# EAGLE design PAM8403 Amplifier Board R2 (EAGLE 9.6.2)
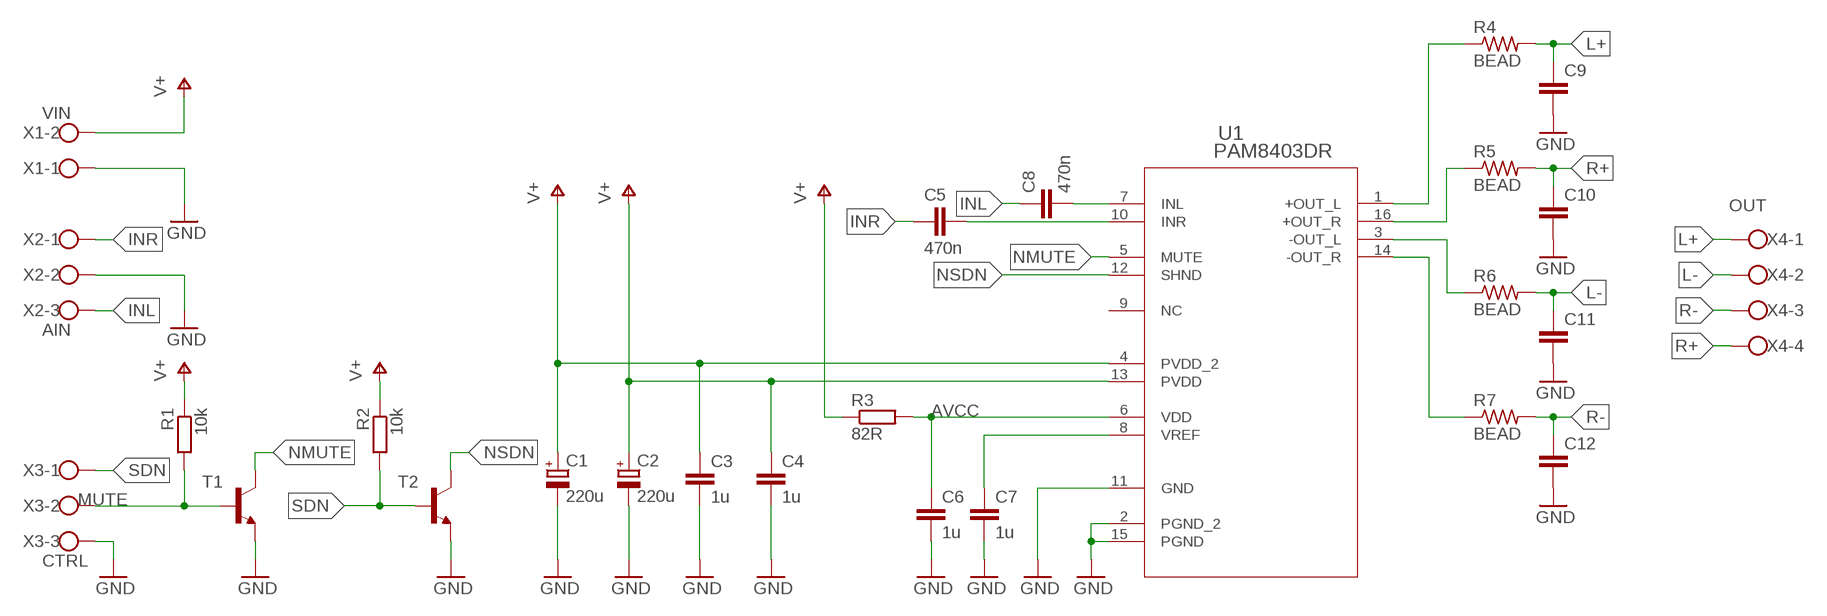
[diagram p0: schematic, sheet 1]

## Parts
C1  220u  CPOL-EUUD-10X10  [UD-10X10_NICHICON]
C2  220u  CPOL-EUUD-10X10  [UD-10X10_NICHICON]
C3  1u  C-EUC0805  [C0805]
C4  1u  C-EUC0805  [C0805]
C5  470n  C-EUC1206  [C1206]
C6  1u  C-EUC0805  [C0805]
C7  1u  C-EUC0805  [C0805]
C8  470n  C-EUC1206  [C1206]
C9  C-EUC0603  [C0603]
C10  C-EUC0603  [C0603]
C11  C-EUC0603  [C0603]
C12  C-EUC0603  [C0603]
R1  10k  R-EU_R0603  [R0603]
R2  10k  R-EU_R0603  [R0603]
R3  82R  R-EU_R1206  [R1206]
R4  BEAD  R-US_R0805  [R0805]
R5  BEAD  R-US_R0805  [R0805]
R6  BEAD  R-US_R0805  [R0805]
R7  BEAD  R-US_R0805  [R0805]
T1  MMBT3904LT1-NPN-SOT23-BEC  [SOT23-BEC]
T2  MMBT3904LT1-NPN-SOT23-BEC  [SOT23-BEC]
U1  PAM8403DR  [SOIC_8403DR_DIO]
X1  VIN  W237-102  [W237-102]
X2  AIN  W237-103  [W237-103]
X3  CTRL  W237-103  [W237-103]
X4  OUT  W237-4  [W237-4]

## Nets
AVCC: C6.1 R3.2 U1.6(VDD)
GND: C1.- C2.- C3.2 C4.2 C6.2 C7.2 C9.2 C10.2 C11.2 C12.2 T1.E T2.E U1.2(PGND_2) U1.11(GND) U1.15(PGND) X1.1 X2.2 X3.3
INL: C8.1 X2.3
INR: C5.1 X2.1
L: C8.2 U1.7(INL)
L+: C9.1 R4.2 X4.1
L-: C11.1 R6.2 X4.2
MUTE: R1.2 T1.B X3.2
N$4: R5.1 U1.16(+OUT_R)
N$5: R6.1 U1.3(-OUT_L)
N$6: R4.1 U1.1(+OUT_L)
N$7: R7.1 U1.14(-OUT_R)
NMUTE: T1.C U1.5(MUTE)
NSDN: T2.C U1.12(SHND)
R: C5.2 U1.10(INR)
R+: C10.1 R5.2 X4.4
R-: C12.1 R7.2 X4.3
SDN: R2.2 T2.B X3.1
V+: C1.+ C2.+ C3.1 C4.1 R1.1 R2.1 R3.1 U1.4(PVDD_2) U1.13(PVDD) X1.2
VREF: C7.1 U1.8(VREF)
Unconnected: U1.9(NC)

## Library data of the parts
C1 C2 = rcl:CPOL-EU: POLARIZED CAPACITOR, European symbol; SPICEPREFIX: C
C3-C12 = rcl:C-EU: CAPACITOR, European symbol; SPICEPREFIX: C
R1-R3 = rcl:R-EU_: RESISTOR, European symbol; SPICEPREFIX: R
R4-R7 = rcl:R-US_: RESISTOR, American symbol; SPICEPREFIX: R
T1 T2 = transistor:*-NPN-: NPN Transistror BF959 corrected 2008.03.06
U1 = user:PAM8403DR; COPYRIGHT: Copyright (C) 2023 Ultra Librarian. All rights reserved.; MANUFACTURER_PART_NUMBER: PAM8403DR; MFR_NAME: Diodes Inc
X1 = con-wago-500:W237-102: WAGO SCREW CLAMP; MPN: 237-102; OC_FARNELL: unknown; OC_NEWARK: 70K9898
X2 X3 = con-wago-500:W237-103: WAGO SCREW CLAMP; MPN: 237-103; OC_FARNELL: unknown; OC_NEWARK: 18M7116
X4 = con-wago-500:W237-4: WAGO SCREW CLAMP; OC_FARNELL: unknown; OC_NEWARK: unknown

## Board
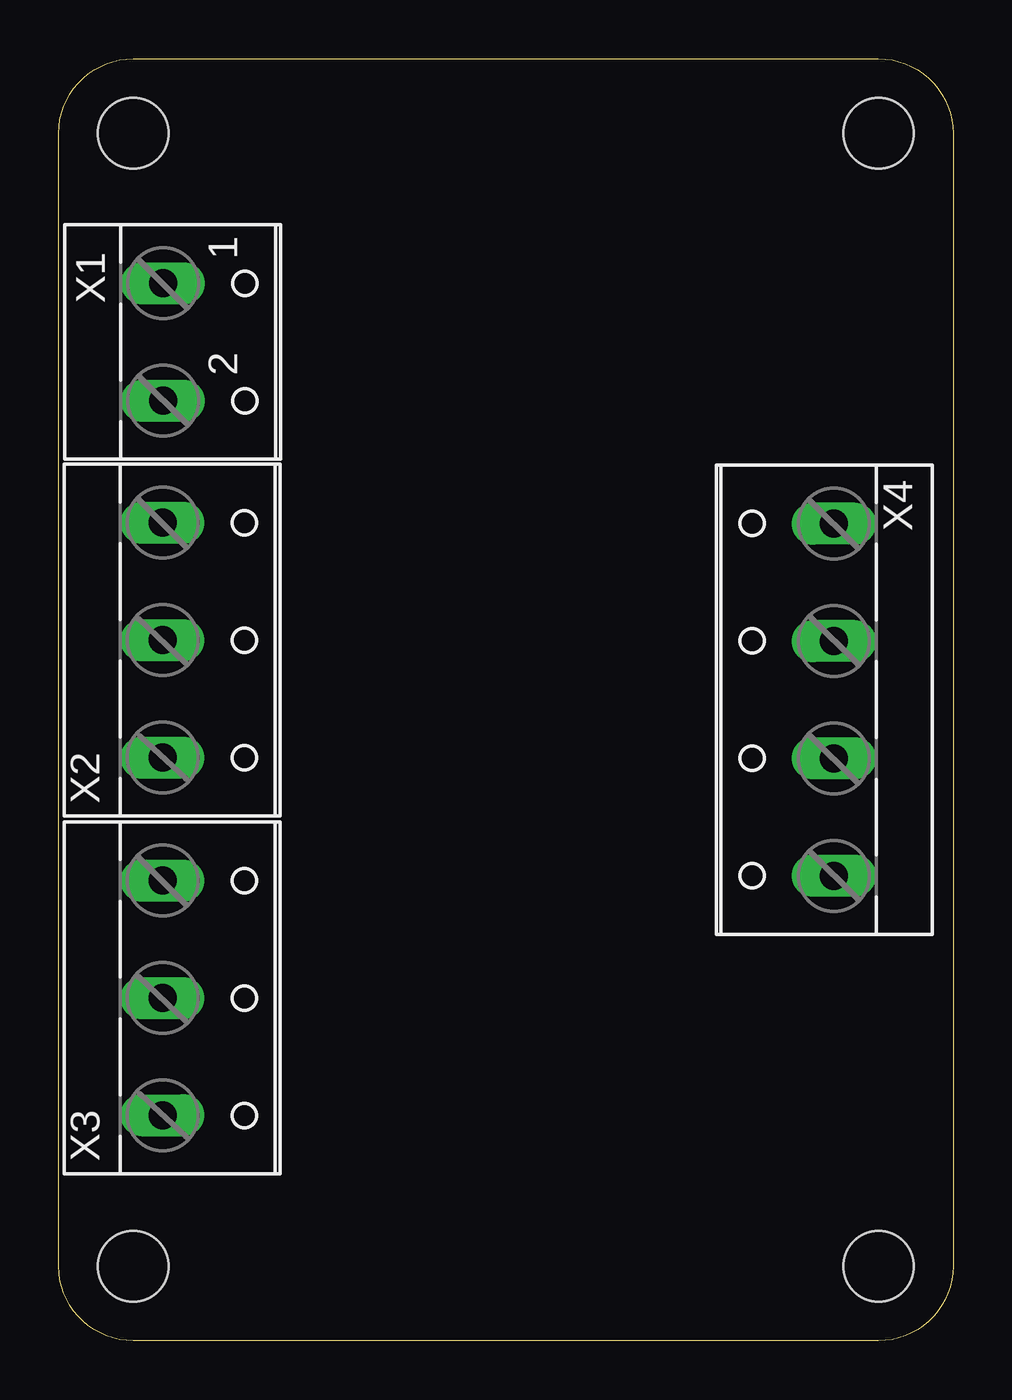
[diagram p1: board, top side]
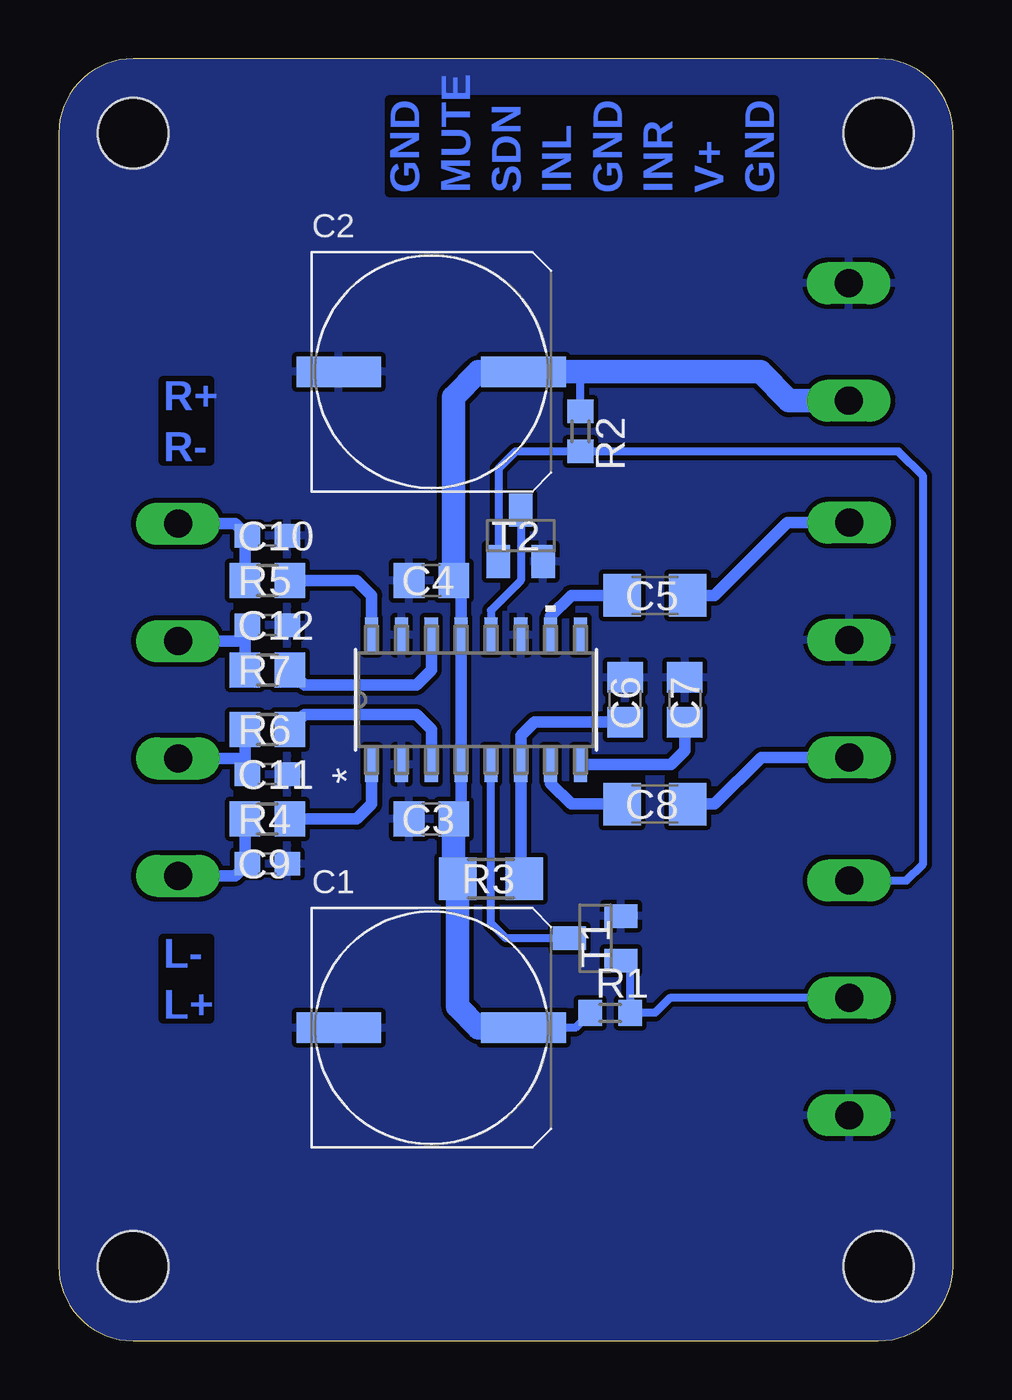
[diagram p2: board, bottom side, seen from below]

Size 38.1 x 54.61 mm. Coordinates in mm from the lower left corner, seen from the top.
Outline: 0,3.18 0,51.44 arc-90 3.18,54.61 34.92,54.61 arc-90 38.1,51.44 38.1,3.18 arc-90 34.92,0 3.18,0 arc-90 0,3.18
Copper layers (1*16): Top 0.035mm / dielectric 1.5mm / Bottom 0.035mm
Design rules "default": minimum track width 0.15mm, minimum drill 0.35mm, track to track 0.2mm, track to pad 0.2mm, pad to pad 0.2mm, via to via 0.2mm, smd to smd 0.2mm, copper to edge 0.002540625mm, drill to drill 6mil, minimum pad ring 10mil, minimum via ring 8mil, stop-mask expansion 4mil, vias tented up to drill 0mil, thermal gap 0.2mm
Holes 3 mm at 3.18,3.18 34.92,3.18 34.92,51.44 3.18,51.44

### Footprints (pad centres in the part's own frame; a part is rotated, then mirrored left to right if it is on the bottom)
UD-10X10_NICHICON = smd 3.6 x 1.3: + 3.925,0; - -3.95,0
C0805 = smd 1.3 x 1.5: 1 -0.95,0; 2 0.95,0
C1206 = smd 1.6 x 1.8: 1 -1.4,0; 2 1.4,0
C0603 = smd 1.1 x 1: 1 -0.85,0; 2 0.85,0
R0603 = smd 1 x 1.1: 1 -0.85,0; 2 0.85,0
R1206 = smd 1.6 x 1.803: 1 -1.422,0; 2 1.422,0
R0805 = smd 1.3 x 1.5: 1 -0.95,0; 2 0.95,0
SOT23-BEC = smd 1 x 1.4: B -0.95,-1.1; C 0,1.1; E 0.95,-1.1
SOIC_8403DR_DIO = smd 1.511 x 0.559: 1 -2.75,4.445; 2 -2.75,3.175; 3 -2.75,1.905; 4 -2.75,0.635; 5 -2.75,-0.635; 6 -2.75,-1.905; 7 -2.75,-3.175; 8 -2.75,-4.445; 9 2.75,-4.445; 10 2.75,-3.175; 11 2.75,-1.905; 12 2.75,-0.635; 13 2.75,0.635; 14 2.75,1.905; 15 2.75,3.175; 16 2.75,4.445
W237-102 = drill 1.194 long: 1 -2.5,-1.27; 2 2.5,-1.27
W237-103 = drill 1.194 long: 1 -5,-1.29; 2 0,-1.29; 3 5,-1.29
W237-4 = drill 1.194 long: 1 -7.5,-1.27; 2 -2.5,-1.27; 3 2.5,-1.27; 4 7.5,-1.27

### Placement (x,y rotation side)
C1  22.23,13.34 0 bottom
C2  22.23,41.28 0 bottom
C3  22.23,22.23 180 bottom
C4  22.23,32.39 180 bottom
C5  12.7,31.75 180 bottom
C6  13.97,27.31 90 bottom
C7  11.43,27.31 90 bottom
C8  12.7,22.86 180 bottom
C9  29.21,20.32 0 bottom
C10  29.21,34.29 0 bottom
C11  29.21,24.13 0 bottom
C12  29.21,30.48 0 bottom
R1  14.61,13.97 0 bottom
R2  15.88,38.73 270 bottom
R3  19.69,19.68 0 bottom
R4  29.21,22.23 180 bottom
R5  29.21,32.39 180 bottom
R6  29.21,26.04 180 bottom
R7  29.21,28.57 180 bottom
T1  15.24,17.14 90 bottom
T2  18.41,34.29 0 bottom
U1  20.32,27.31 90 bottom
X1  5.71,42.55 270 top
X2  5.71,29.85 270 top
X3  5.71,14.61 270 top
X4  31.75,27.31 90 top

### Tracks (layer width: path | path; a pad name or v marks a point on that pad's centre or on a via)
AVCC
  Bottom 0.5: C6.1 17.84,26.36 18.41,25.78 U1.6 18.41,19.84 R3.2
GND
  pour Bottom: -0.63,55.25 38.73,55.25 38.73,-1.27 -0.63,-1.27
INL
  Bottom 0.5: X2.3 8.18,24.84 10.16,22.86 C8.1
INR
  Bottom 0.5: X2.1 7.07,34.84 10.16,31.75 C5.1
L
  Bottom 0.5: C8.2 16.26,22.86 17.15,23.75 U1.7
L+
  Bottom 0.5: R4.2 30.16,20.42 C9.1 30.57,19.8 X4.1
L-
  Bottom 0.5: R6.2 30.16,24.77 | 30.16,24.77 30.16,24.23 C11.1 | X4.2 30.2,24.8 30.16,24.77
MUTE
  Bottom 0.35: T1.B 13.76,15.81 R1.2 12.7,13.97 12.07,14.61 X3.2
N$4
  Bottom 0.5: U1.16 24.77,31.75 25.4,32.39 R5.1
N$5
  Bottom 0.5: R6.1 27.62,26.67 22.86,26.67 22.23,26.04 U1.3
N$6
  Bottom 0.5: U1.1 24.77,22.86 25.4,22.23 R4.1
N$7
  Bottom 0.5: R7.1 27.62,27.94 22.86,27.94 22.23,28.57 U1.14
NMUTE
  Bottom 0.35: T1.C 19.05,17.14 19.69,17.78 U1.5
NSDN
  Bottom 0.35: T2.C 18.41,32.39 19.69,31.11 U1.12
R
  Bottom 0.5: C5.2 16.26,31.75 17.15,30.86 U1.10
R+
  Bottom 0.5: R5.2 30.16,34.19 C10.1 30.57,34.81 X4.4
R-
  Bottom 0.5: R7.2 30.16,29.85 | 30.16,29.85 30.16,30.38 C12.1 | X4.3 30.2,29.81 30.16,29.85
SDN
  Bottom 0.35: T2.B 19.37,37.15 18.63,37.89 R2.2 2.32,37.89 1.27,36.83 1.27,20.32 1.98,19.61 X3.1
V+
  Bottom 0.35: R1.1 16.09,13.34 C1.+ | R2.1 15.88,41.28
  Bottom 0.5: C3.1 20.95,22.55 U1.4 U1.13 20.95,32.06 C4.1
  Bottom 1: C1.+ 20.2,13.34 21.11,14.24 R3.1 21.28,19.85 C3.1 | C4.1 21.28,40.2 20.2,41.28 C2.+ 15.88,41.28 8.21,41.28 6.98,40.05 X1.2
VREF
  Bottom 0.5: U1.8 12.02,24.55 11.43,25.15 C7.1

### Text on the board
Bottom: GND / MUTE / SDN / INL / GND / INR / V+ / GND | R+ / R- | L- / L+